# EAGLE design base_v2 (EAGLE 6.5.0)
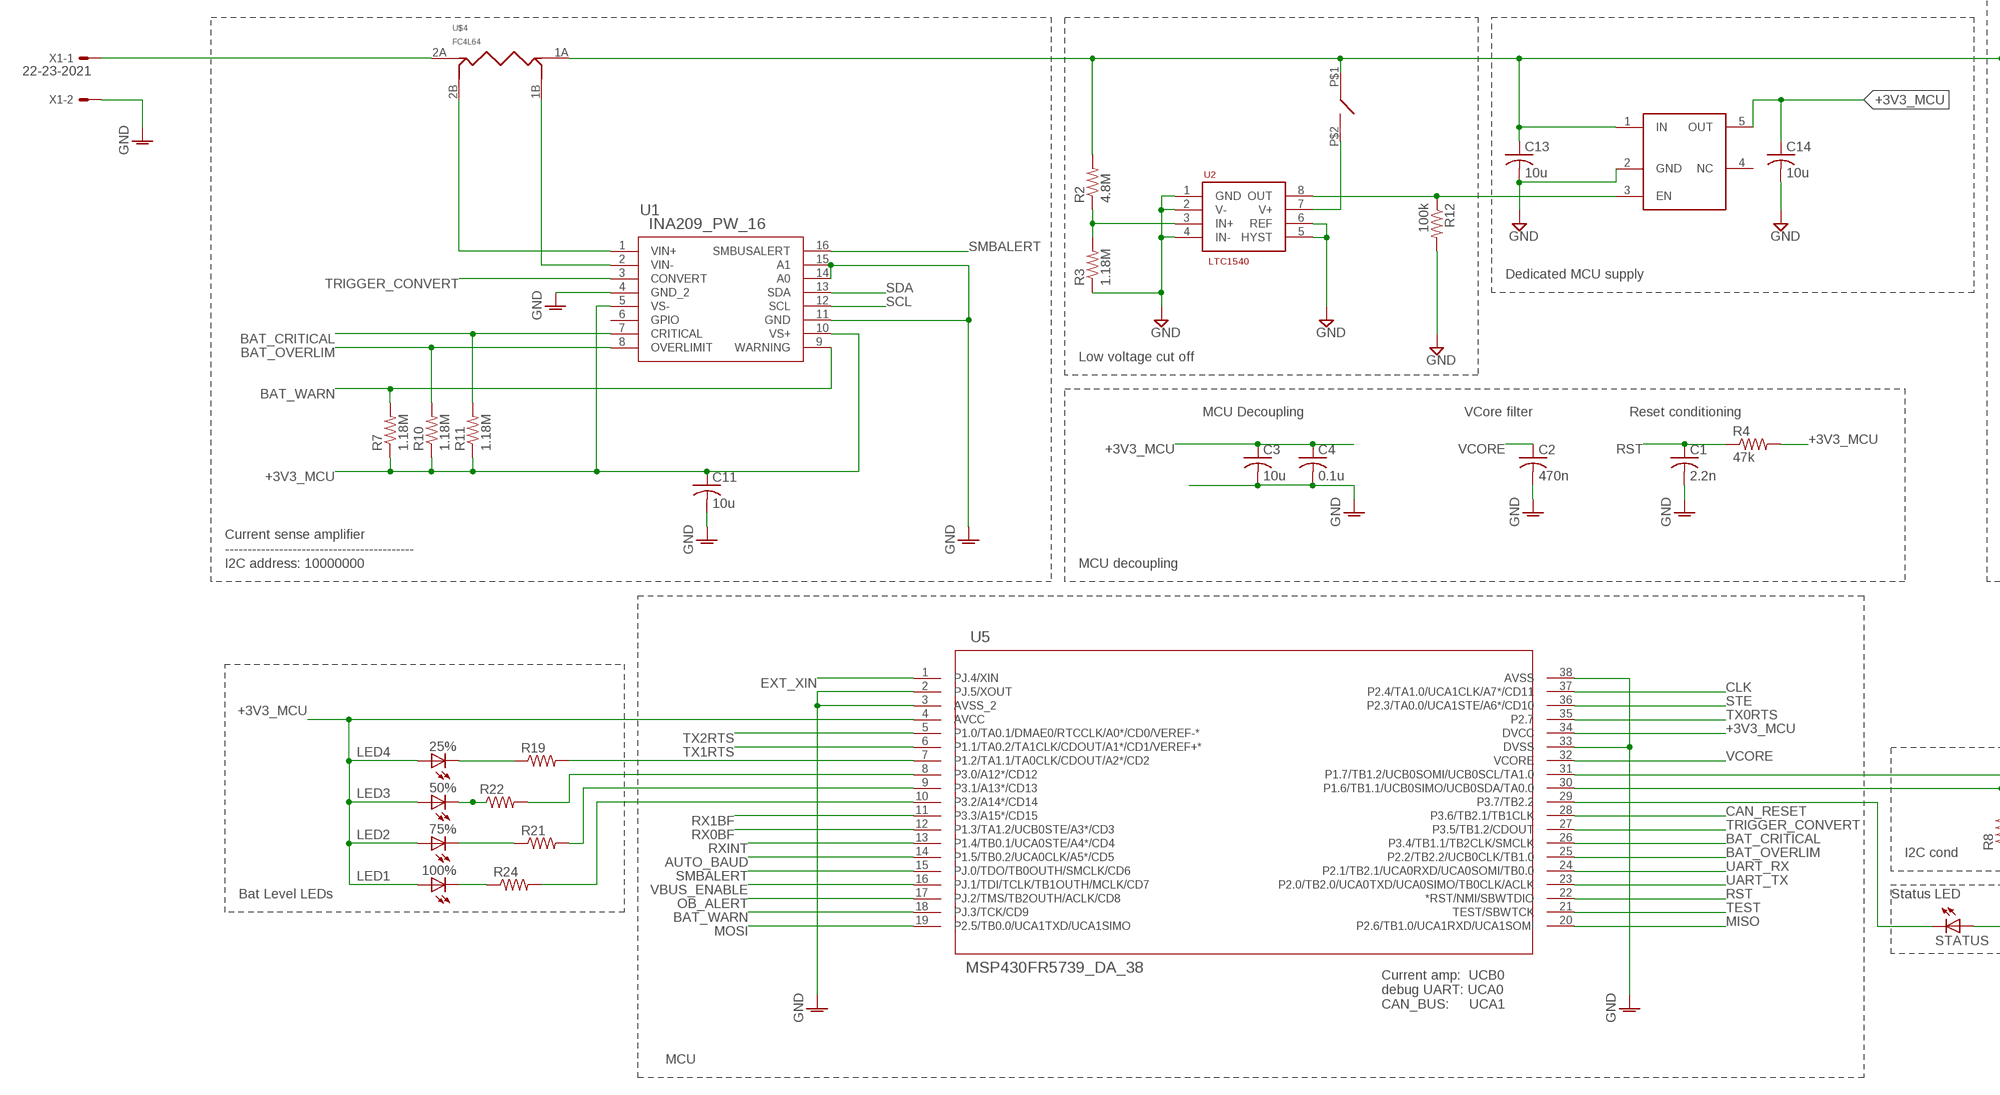
[diagram p0: schematic, sheet 1, part 1 of 2]
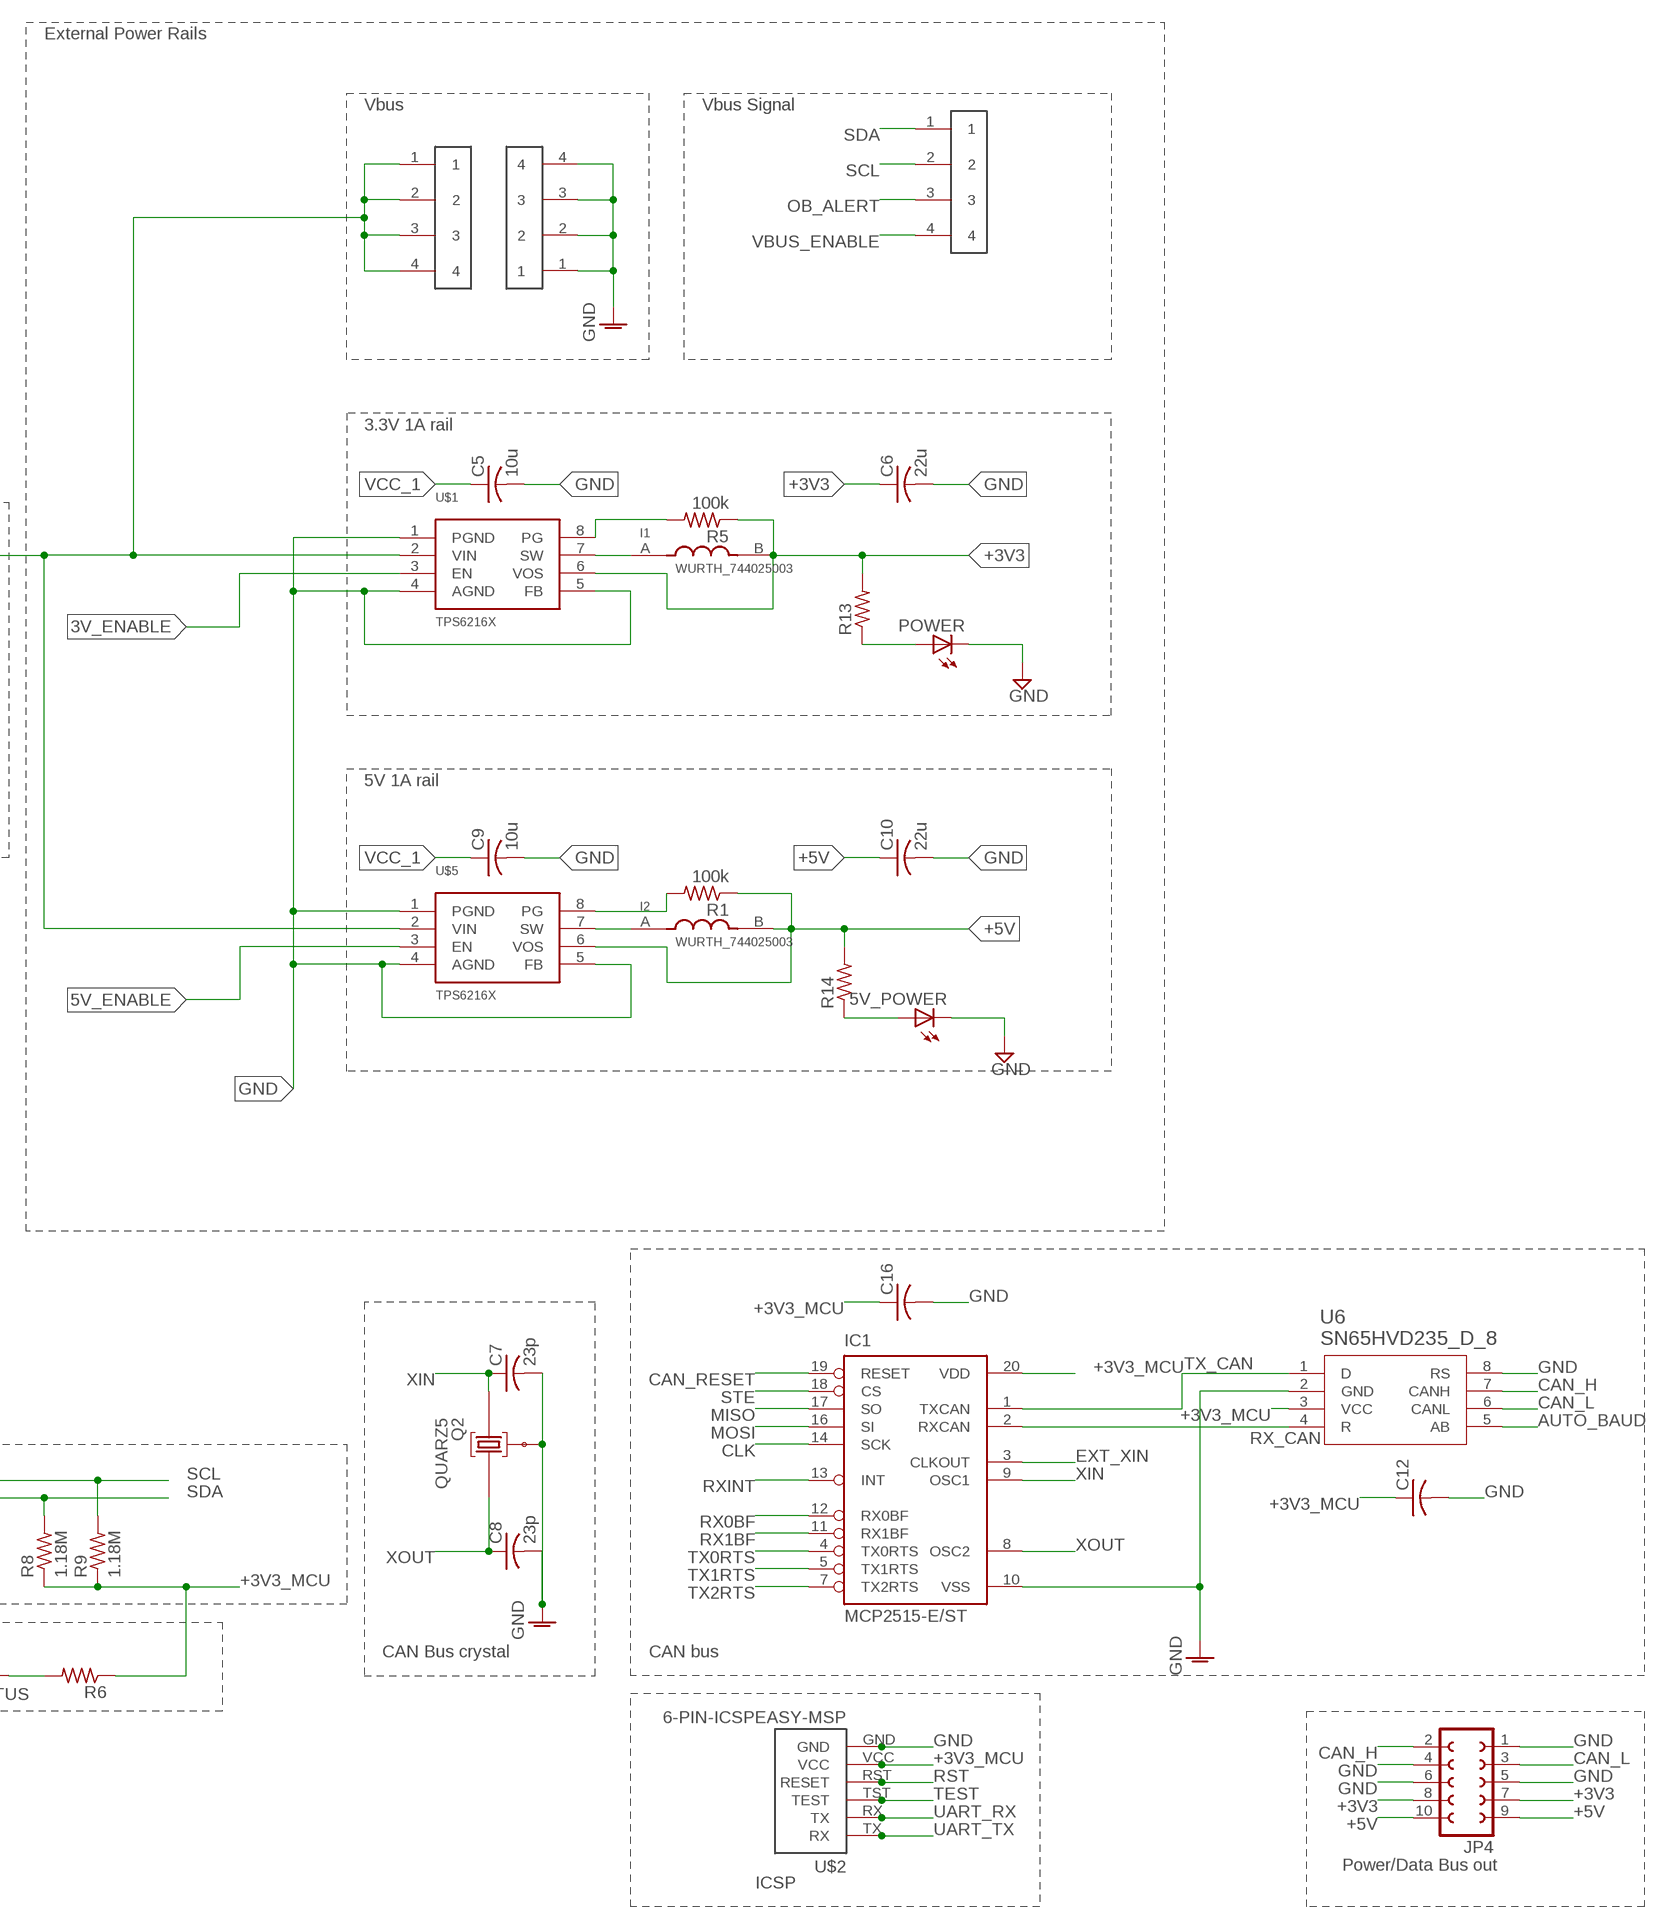
[diagram p1: schematic, sheet 1, part 2 of 2]

## Parts
5V_POWER  LEDCHIP-LED0603  [CHIP-LED0603]
25%  LEDCHIP-LED0603  [CHIP-LED0603]
50%  LEDCHIP-LED0603  [CHIP-LED0603]
75%  LEDCHIP-LED0603  [CHIP-LED0603]
100%  LEDCHIP-LED0603  [CHIP-LED0603]
C1  2.2n  C-USC1206  [C1206]
C2  470n  C-USC1206  [C1206]
C3  10u  C-USC1206  [C1206]
C4  0.1u  C-USC1206  [C1206]
C5  10u  C-USC1206  [C1206]
C6  22u  C-USC1206  [C1206]
C7  23p  C-USC1206  [C1206]
C8  23p  C-USC1206  [C1206]
C9  10u  C-USC1206  [C1206]
C10  22u  C-USC1206  [C1206]
C11  10u  C-USC1206  [C1206]
C12  C-USC0603  [C0603]
C13  10u  C-USC1206  [C1206]
C14  10u  C-USC1206  [C1206]
C16  C-USC0603  [C0603]
I1  WURTH_744025003  [INDUCTOR]
I2  WURTH_744025003  [INDUCTOR]
IC1  MCP2515-E/ST  [TSSOP20]
JP4  FE05-2  [FE05-2]
POWER  LEDCHIP-LED0603  [CHIP-LED0603]
Q2  QUARZ5  [QUARZ5]
R1  100k  R-US_R1206  [R1206]
R2  4.8M  R-US_R1206  [R1206]
R3  1.18M  R-US_R1206  [R1206]
R4  47k  R-US_R1206  [R1206]
R5  100k  R-US_R1206  [R1206]
R6  R-US_R0603  [R0603]
R7  1.18M  R-US_R0805  [R0805]
R8  1.18M  R-US_R0805  [R0805]
R9  1.18M  R-US_R0805  [R0805]
R10  1.18M  R-US_R0805  [R0805]
R11  1.18M  R-US_R0805  [R0805]
R12  100k  R-US_R1206  [R1206]
R13  R-US_R0603  [R0603]
R14  R-US_R0603  [R0603]
R19  R-US_R0603  [R0603]
R21  R-US_R0603  [R0603]
R22  R-US_R0603  [R0603]
R24  R-US_R0603  [R0603]
STATUS  LEDCHIP-LED0603  [CHIP-LED0603]
U1  INA209_PW_16  [PW16]
U2  LTC1540  [S8]
U5  MSP430FR5739_DA_38  [DA38]
U6  SN65HVD235_D_8  [D8]
U$1  TPS6216X  [DGK-8(VSSOP)]
U$2  6-PIN-ICSPEASY-MSP  [EASYMSP-6PIN]
U$3  1X4_HEADER  [1X4-.1HEADER]
U$4  FC4L64  [FC4L64]
U$5  TPS6216X  [DGK-8(VSSOP)]
U$6  TPS70930-Q1  [SOT-23]
U$7  A6SN  DIP1-SMT  [DIP1-SMT]
U$8  1X4_HEADER  [1X4-.1HEADER]
U$11  1X4_HEADER  [1X4-.1HEADER]
X1  22-23-2021  [22-23-2021]

## Nets
3V_ENABLE: U$1.3(EN)
5V_ENABLE: U$5.3(EN)
+3V3: C6.1 I1.B JP4.7 JP4.8 R5.1 R13.2 U$1.6(VOS)
+3V3_MCU: 25%.A 50%.A 75%.A 100%.A C3.1 C4.1 C11.1 C12.1 C14.1 C16.1 IC1.20(VDD) R4.2 R6.1 R7.1 R8.1 R9.1 R10.1 R11.1 U1.5(VS-) U1.10(VS+) U5.4(AVCC) U5.34(DVCC) U6.3(VCC) U$2.VCC U$6.5(OUT)
+5V: C10.1 I2.B JP4.9 JP4.10 R1.1 R14.2 U$5.6(VOS)
AUTO_BAUD: U5.14(P1.5/TB0.2/UCA0CLK/A5*/CD5) U6.5(AB)
BAT_CRITICAL: R11.2 U1.7(CRITICAL) U5.26(P3.4/TB1.1/TB2CLK/SMCLK)
BAT_OVERLIM: R10.2 U1.8(OVERLIMIT) U5.25(P2.2/TB2.2/UCB0CLK/TB1.0)
BAT_WARN: R7.2 U1.9(WARNING) U5.18(PJ.3/TCK/CD9)
CAN_H: JP4.2 U6.7(CANH)
CAN_L: JP4.3 U6.6(CANL)
CAN_RESET: IC1.19(RESET) U5.28(P3.6/TB2.1/TB1CLK)
CLK: IC1.14(SCK) U5.37(P2.4/TA1.0/UCA1CLK/A7*/CD11)
EXT_XIN: IC1.3(CLKOUT) U5.1(PJ.4/XIN)
GND: 5V_POWER.C C1.2 C2.2 C3.2 C4.2 C5.2 C6.2 C7.2 C8.2 C9.2 C10.2 C11.2 C12.2 C13.2 C14.2 C16.2 IC1.10(VSS) JP4.1 JP4.4 JP4.5 JP4.6 POWER.C Q2.GND@0 R3.1 R12.2 U1.4(GND_2) U1.11(GND) U1.14(A0) U1.15(A1) U2.1(GND) U2.2(V-) U2.4(IN-) U2.5(HYST) U2.6(REF) U5.2(PJ.5/XOUT) U5.3(AVSS_2) U5.33(DVSS) U5.38(AVSS) U6.2(GND) U6.8(RS) U$1.1(PGND) U$1.4(AGND) U$1.5(FB) U$2.GND U$3.1 U$3.2 U$3.3 U$3.4 U$5.1(PGND) U$5.4(AGND) U$5.5(FB) U$6.2(GND) X1.2
LED1: R24.2 U5.10(P3.2/A14*/CD14)
LED2: R21.2 U5.9(P3.1/A13*/CD13)
LED3: R22.2 U5.8(P3.0/A12*/CD12)
LED4: R19.2 U5.7(P1.2/TA1.1/TA0CLK/CDOUT/A2*/CD2)
MISO: IC1.17(SO) U5.20(P2.6/TB1.0/UCA1RXD/UCA1SOMI)
MOSI: IC1.16(SI) U5.19(P2.5/TB0.0/UCA1TXD/UCA1SIMO)
N$1: 25%.C R19.1
N$2: U2.7(V+) U$7.P$2
N$3: R2.1 R3.2 U2.3(IN+)
N$4: I1.A U$1.7(SW)
N$5: I2.A U$5.7(SW)
N$6: R5.2 U$1.8(PG)
N$7: R1.2 U$5.8(PG)
N$8: U$4.2A(1A) X1.1
N$9: POWER.A R13.1
N$10: 5V_POWER.A R14.1
N$11: U1.1(VIN+) U$4.2B(1B)
N$12: U1.2(VIN-) U$4.1B(2B)
N$13: R6.2 STATUS.A
N$33: 50%.C R22.1
N$34: 75%.C R21.1
N$35: 100%.C R24.1
NC: STATUS.C U5.29(P3.7/TB2.2)
OB_ALERT: U5.17(PJ.2/TMS/TB2OUTH/ACLK/CD8) U$8.3
RST: C1.1 R4.1 U5.22(*RST/NMI/SBWTDIO) U$2.RST(RESET)
RX0BF: IC1.12(RX0BF) U5.12(P1.3/TA1.2/UCB0STE/A3*/CD3)
RX1BF: IC1.11(RX1BF) U5.11(P3.3/A15*/CD15)
RX_CAN: IC1.2(RXCAN) U6.4(R)
RXINT: IC1.13(INT) U5.13(P1.4/TB0.1/UCA0STE/A4*/CD4)
SCL: R9.2 U1.12(SCL) U5.31(P1.7/TB1.2/UCB0SOMI/UCB0SCL/TA1.0) U$8.2
SDA: R8.2 U1.13(SDA) U5.30(P1.6/TB1.1/UCB0SIMO/UCB0SDA/TA0.0) U$8.1
SMBALERT: U1.16(SMBUSALERT) U5.15(PJ.0/TDO/TB0OUTH/SMCLK/CD6)
STE: IC1.18(CS) U5.36(P2.3/TA0.0/UCA1STE/A6*/CD10)
TEST: U5.21(TEST/SBWTCK) U$2.TST(TEST)
TRIGGER_CONVERT: U1.3(CONVERT) U5.27(P3.5/TB1.2/CDOUT)
TX0RTS: IC1.4(TX0RTS) U5.35(P2.7)
TX1RTS: IC1.5(TX1RTS) U5.6(P1.1/TA0.2/TA1CLK/CDOUT/A1*/CD1/VEREF+*)
TX2RTS: IC1.7(TX2RTS) U5.5(P1.0/TA0.1/DMAE0/RTCCLK/A0*/CD0/VEREF-*)
TX_CAN: IC1.1(TXCAN) U6.1(D)
UART_RX: U5.24(P2.1/TB2.1/UCA0RXD/UCA0SOMI/TB0.0) U$2.RX(TX)
UART_TX: U5.23(P2.0/TB2.0/UCA0TXD/UCA0SIMO/TB0CLK/ACLK) U$2.TX(RX)
VBUS_ENABLE: U5.16(PJ.1/TDI/TCLK/TB1OUTH/MCLK/CD7) U$8.4
VCC_1: C5.1 C9.1 C13.1 R2.2 U$1.2(VIN) U$4.1A(2A) U$5.2(VIN) U$6.1(IN) U$7.P$1 U$11.1 U$11.2 U$11.3 U$11.4
VCORE: C2.1 U5.32(VCORE)
VENABLE: R12.1 U2.8(OUT) U$6.3(EN)
XIN: C7.1 IC1.9(OSC1) Q2.2
XOUT: C8.1 IC1.8(OSC2) Q2.1
Unconnected: U1.6(GPIO) U$6.4(NC)

## Notes on the sheet
- External Power Rails
- Vbus | Vbus Signal
- 3.3V 1A rail
- 5V 1A rail
- Dedicated MCU supply
- Low voltage cut off
- MCU Decoupling | VCore filter | Reset conditioning
- Current sense amplifier
  ------------------------------------------
  I2C address: 10000000
- MCU decoupling
- I2C cond
- Bat Level LEDs | Status LED
- CAN Bus crystal | CAN bus
- Current amp:  UCB0
  debug UART: UCA0
  CAN_BUS:     UCA1
- MCU
- Power/Data Bus out
- ICSP

## Library data of the parts
5V_POWER 25% 50% 75% 100% POWER STATUS = adafruit:LED: LED OSRAM: - CHIPLED LG R971, LG N971, LY N971, LG Q971, LY Q971, LO R971, LY R971 LH N974, LH R974 LS Q976, LO Q976, LY Q976 LO Q996 - Hyper CHIPLED LW Q18S LB Q993, LB Q99A, LB R99A - SideLED LS A670, LO A670, LY A670, LG A670, LP A670 LB A673, LV A673, LT A673, LW A673 LH A674 LY A675 LS A676, LA A676, LO A676, LY A676, LW A676 LS A679, LY A679, LG A679 - Hyper Micro SIDELED® LS Y876, LA Y876, LO Y876, LY Y876 LT Y87S - SmartLED LW L88C, LW L88S LB L89C, LB L89S, LG L890 LS L89K, LO L89K, LY L89K LS L896, LA L896, LO L896, LY L896 - TOPLED LS T670, LO T670, LY T670, LG T670, LP T670 LSG T670, LSP T670, LSY T670, LOP T670, LYG T670 LG T671, LOG T671, LSG T671 LB T673, LV T673, LT T673, LW T673 LH T674 LS T676, LA T676, LO T676, LY T676, LB T676, LH T676, LSB T676, LW T676 LB T67C, LV T67C, LT T67C, LS T67K, LO T67K, LY T67K, LW E67C LS E67B, LA E67B, LO E67B, LY E67B, LB E67C, LV E67C, LT E67C LW T67C LS T679, LY T679, LG T679 LS T770, LO T770, LY T770, LG T770, LP T770 LB T773, LV T773, LT T773, LW T773 LH T774 LS E675, LA E675, LY E675, LS T675 LS T776, LA T776, LO T776, LY T776, LB T776 LHGB T686 LT T68C, LB T68C - Hyper Mini TOPLED® LB M676 - Mini TOPLED Santana® LG M470 LS M47K, LO M47K, LY M47K Source: http://www.osram.convergy.de/
C1-C14 C16 = adafruit:C-US: CAPACITOR, American symbol
I1 I2 = misc_passives:WURTH_744025003
IC1 = mcp2515:MCP2515
JP4 = con-lsta:FE05-2: FEMALE HEADER; OC_FARNELL: unknown; OC_NEWARK: unknown
Q2 = sMSP430:QUARZ5
R1-R14 R19 R21 R22 R24 = adafruit:R-US_: RESISTOR, American symbol
U1 = TexasInstruments:INA209_PW_16; DATASHEETURL: http://www.ti.com/lit/gpn/INA209; DESCRIPTION: High-Side Measurement, Bi-Directional Current/Power Monitor with I2C Interface; FAMILY_NAME: CURRENT SHUNT MONITOR; GENERIC_PART_NUMBER: INA209; INDUSTRY_STD_PKG_TYPE: TSSOP; MANUFACTURER: Texas Instruments; MANUFACTURER_PART_NUMBER: ina209_pw_16; PACKAGE_DESIGNATOR: PW; PIN_COUNT: 16; VENDOR: Texas Instruments
U2 = linear:LTC1540
U5 = TexasInstruments:MSP430FR5739_DA_38; DATASHEETURL: http://www.ti.com/lit/gpn/MSP430FR5739; DESCRIPTION: MSP430FR573x,MSP430FR572x Mixed Signal Microcontroller; FAMILY_NAME: FRAM Series; GENERIC_PART_NUMBER: MSP430FR5739; INDUSTRY_STD_PKG_TYPE: TSSOP; MANUFACTURER: Texas Instruments; MANUFACTURER_PART_NUMBER: msp430fr5739_da_38; PACKAGE_DESIGNATOR: DA; PIN_COUNT: 38; VENDOR: Texas Instruments
U6 = TexasInstruments:SN65HVD235_D_8; DATASHEETURL: http://www.ti.com/lit/gpn/SN65HVD235; DESCRIPTION: 3.3V CAN with Standby Mode, Autobaud Loop-back; FAMILY_NAME: CAN; GENERIC_PART_NUMBER: SN65HVD235; INDUSTRY_STD_PKG_TYPE: SOIC; MANUFACTURER: Texas Instruments; MANUFACTURER_PART_NUMBER: sn65hvd235_d_8; PACKAGE_DESIGNATOR: D; PIN_COUNT: 8; VENDOR: Texas Instruments
U$1 U$5 = TexasInstruments:TPS6216X
U$2 = LaunchFET:6-PIN-ICSP: 6 pin easy-msp formatted headers. Designed to make programming target boards with MSP430 Launchpad easier. EASYMSP: standard .05" pitch header to match launchpad SAFEMSP: .05" header with .025" offset Vcc to keep Geordi away
U$3 U$8 U$11 = connectors:1X4_HEADER
U$4 = misc_passives:FC4L64
U$6 = TexasInstruments:TPS70930-Q1
U$7 = misc_passives:DIP1-SMT
X1 = con-molex:22-23-2021: .100" (2.54mm) Center Header - 2 Pin; MF: MOLEX; MPN: 22-23-2021; OC_FARNELL: 1462926; OC_NEWARK: 25C3832

## Board
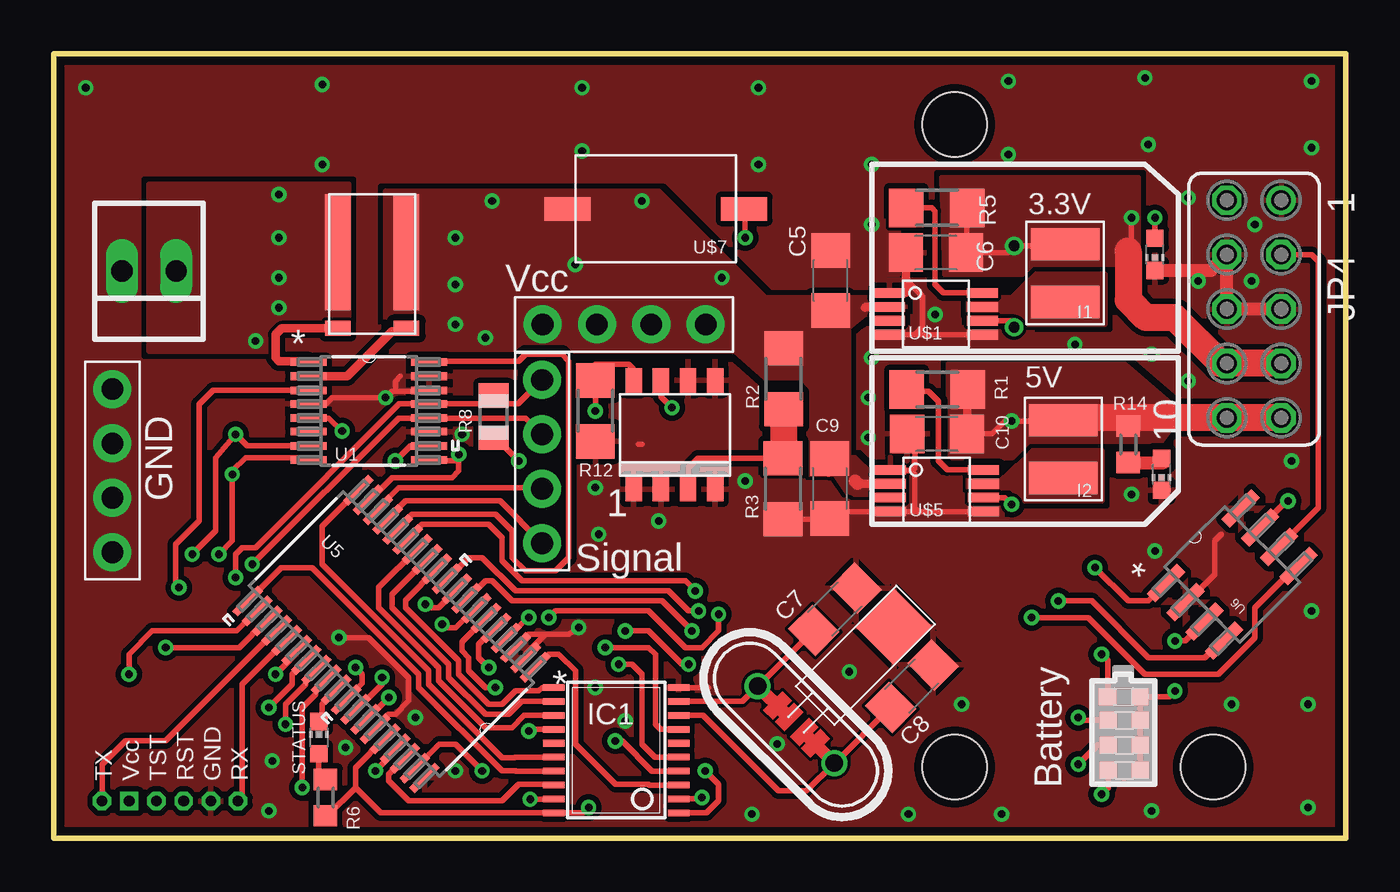
[diagram p2: board, top side]
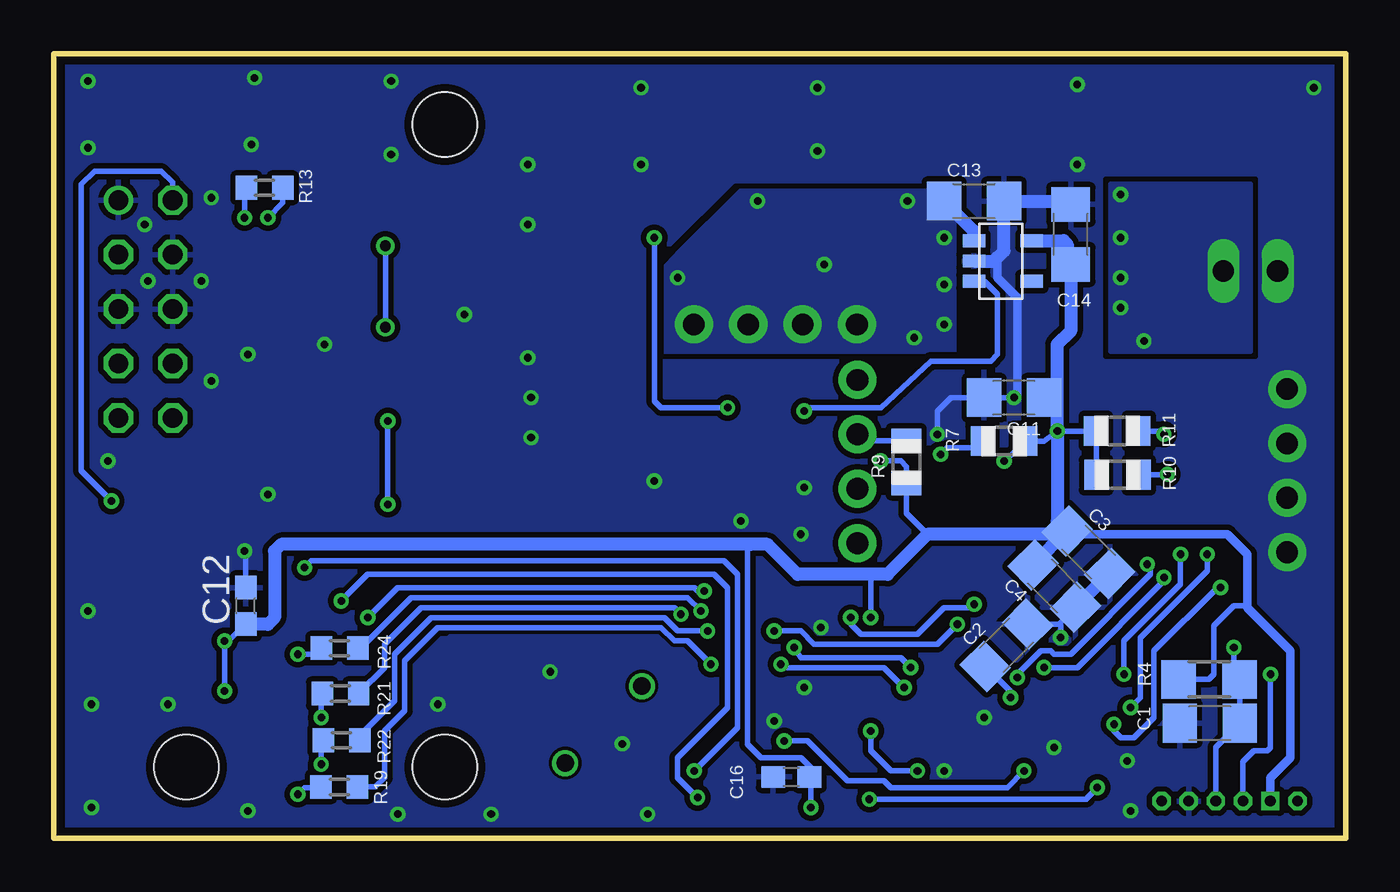
[diagram p3: board, bottom side, seen from below]

Size 60.37 x 36.63 mm. Coordinates in mm from the lower left corner, seen from the top.
Outline: 0,36.63 60.37,36.63 60.37,0 0,0 0,36.63
Copper layers (1*16): Top 0.0356mm / dielectric 1.5011mm / Bottom 0.0356mm
Design rules "oshpark": minimum track width 6mil, minimum drill 13mil, track to track 6mil, track to pad 6mil, pad to pad 6mil, via to via 6mil, smd to smd 6mil, copper to edge 15mil, drill to drill 6mil, minimum pad ring 7mil, minimum via ring 7mil, stop-mask expansion 4mil, vias tented up to drill 0mil, thermal gap 10mil
Holes 3 mm at 42.09,3.31 42.09,33.31 54.16,3.31

### Footprints (pad centres in the part's own frame; a part is rotated, then mirrored left to right if it is on the bottom)
CHIP-LED0603 = smd 0.8 x 0.8: A 0,-0.75; C 0,0.75
C1206 = smd 1.6 x 1.8: 1 -1.4,0; 2 1.4,0
C0603 = smd 1.1 x 1: 1 -0.85,0; 2 0.85,0
INDUCTOR = smd 1.5 x 3.2: A -1.35,0; B 1.35,0
TSSOP20 = smd 0.305 x 0.991: 1 -2.925,-2.918; 2 -2.275,-2.918; 3 -1.625,-2.918; 4 -0.975,-2.918; 5 -0.325,-2.918; 6 0.325,-2.918; 7 0.975,-2.918; 8 1.625,-2.918; 9 2.275,-2.918; 10 2.925,-2.918; 11 2.925,2.918; 12 2.275,2.918; 13 1.625,2.918; 14 0.975,2.918; 15 0.325,2.918; 16 -0.325,2.918; 17 -0.975,2.918; 18 -1.625,2.918; 19 -2.275,2.918; 20 -2.925,2.918
FE05-2 = drill 0.914: 1 -5.08,1.27 | drill 0.914 octagon: 2 -5.08,-1.27; 3 -2.54,1.27; 4 -2.54,-1.27; 5 0,1.27; 6 0,-1.27; 7 2.54,1.27; 8 2.54,-1.27; 9 5.08,1.27; 10 5.08,-1.27
QUARZ5 = drill 0.813: 1 1.53,1.773; 2 1.52,-3.303 | smd 2.54 x 2.54: GND@0 -4.941,-0.762
R1206 = smd 1.6 x 1.803: 1 -1.422,0; 2 1.422,0
R0603 = smd 1 x 1.1: 1 -0.85,0; 2 0.85,0
R0805 = smd 1.1 x 1.4: 1 -1,0; 2 1,0
PW16 = smd 1.676 x 0.356: 1 -2.819,2.286; 2 -2.819,1.626; 3 -2.819,0.965; 4 -2.819,0.33; 5 -2.819,-0.33; 6 -2.819,-0.965; 7 -2.819,-1.626; 8 -2.819,-2.286; 9 2.819,-2.286; 10 2.819,-1.626; 11 2.819,-0.965; 12 2.819,-0.33; 13 2.819,0.33; 14 2.819,0.965; 15 2.819,1.626; 16 2.819,2.286
S8 = smd 0.762 x 1.143: 1 -2.54,-2.54; 2 -1.27,-2.54; 3 0,-2.54; 4 1.27,-2.54; 5 1.27,2.54; 6 0,2.54; 7 -1.27,2.54; 8 -2.54,2.54
DA38 = smd 1.676 x 0.356: 1 -3.658,5.842; 2 -3.658,5.207; 3 -3.658,4.547; 4 -3.658,3.912; 5 -3.658,3.251; 6 -3.658,2.591; 7 -3.658,1.956; 8 -3.658,1.295; 9 -3.658,0.66; 10 -3.658,0; 11 -3.658,-0.66; 12 -3.658,-1.295; 13 -3.658,-1.956; 14 -3.658,-2.591; 15 -3.658,-3.251; 16 -3.658,-3.912; 17 -3.658,-4.547; 18 -3.658,-5.207; 19 -3.658,-5.842; 20 3.658,-5.842; 21 3.658,-5.207; 22 3.658,-4.547; 23 3.658,-3.912; 24 3.658,-3.251; 25 3.658,-2.591; 26 3.658,-1.956; 27 3.658,-1.295; 28 3.658,-0.66; 29 3.658,0; 30 3.658,0.66; 31 3.658,1.295; 32 3.658,1.956; 33 3.658,2.591; 34 3.658,3.251; 35 3.658,3.912; 36 3.658,4.547; 37 3.658,5.207; 38 3.658,5.842
D8 = smd 1.981 x 0.559: 1 -2.464,1.905; 2 -2.464,0.635; 3 -2.464,-0.635; 4 -2.464,-1.905; 5 2.464,-1.905; 6 2.464,-0.635; 7 2.464,0.635; 8 2.464,1.905
DGK-8(VSSOP) = smd 0.45 x 1.45: 1 -0.975,-2.175; 2 -0.325,-2.175; 3 0.325,-2.175; 4 0.975,-2.175; 5 0.975,2.175; 6 0.325,2.175; 7 -0.325,2.175; 8 -0.975,2.175
EASYMSP-6PIN = drill 0.5 octagon: GND 0,-1.27; RST 0,0; RX 0,-2.54; TST 0,1.27; TX 0,3.81 | drill 0.5 square: VCC 0,2.54
1X4-.1HEADER = drill 1.016 pad 1.778: 1 -5.08,0; 2 -2.54,0; 3 0,0; 4 2.54,0
FC4L64 = smd 1.2 x 5.4: 1A -1.6,2.7; 2A 1.6,2.7 | smd 1.2 x 0.7: 1B -1.6,6.25; 2B 1.6,6.25
SOT-23 = smd 0.6 x 1.05: 1 -0.95,0; 2 0,0; 3 0.95,0; 4 0.95,2.7; 5 -0.95,2.7
DIP1-SMT = smd 1.1 x 2.15: P$1 0,4.125; P$2 0,-4.125
22-23-2021 = drill 1 long: 1 -1.27,0; 2 1.27,0

### Placement (x,y rotation side)
5V_POWER  51.75,16.98 180 top
25%  50.01,3.17 90 top
50%  50.01,4.34 90 top
75%  50.01,5.51 90 top
100%  49.99,6.6 90 top
C1  6.36,5.36 180 bottom
C2  15.86,9 45 bottom
C3  12.03,13.35 315 bottom
C4  13.62,11.77 315 bottom
C5  36.29,26.03 90 top
C6  41.22,27.33 180 top
C7  36.5,10.68 45 top
C8  40.09,7.09 45 top
C9  36.26,16.32 270 top
C10  41.27,18.87 180 top
C11  15.5,20.56 180 bottom
C12  51.39,10.84 90 bottom
C13  17.37,29.74 0 bottom
C14  12.86,28.18 90 bottom
C16  25.91,2.85 180 bottom
I1  47.25,26.38 90 top
I2  47.16,18.16 90 top
IC1  26.28,4.1 90 top
JP4  56.07,24.7 270 top
POWER  51.44,27.25 180 top
Q2  36.3,5.83 225 top
R1  41.27,20.94 180 top
R2  34.1,21.44 90 top
R3  34.07,16.31 90 top
R4  6.39,7.41 180 bottom
R5  41.25,29.43 180 top
R6  12.7,1.89 90 top
R7  15.97,18.54 180 bottom
R8  20.56,19.67 90 top
R9  20.54,17.56 90 bottom
R10  10.67,16.96 0 bottom
R11  10.68,19 0 bottom
R12  25.31,19.94 270 top
R13  50.51,30.36 0 bottom
R14  50.2,18.38 90 top
R19  47.02,2.39 0 bottom
R21  46.97,6.74 0 bottom
R22  46.91,4.56 0 bottom
R24  47,8.86 0 bottom
STATUS  12.39,4.69 0 top
U1  14.73,19.94 0 top
U2  29.64,18.83 0 top
U5  15.78,9.52 225 top
U6  55.06,12.31 45 top
U$1  41.22,24.48 270 top
U$2  6.08,1.72 90 top
U$3  2.75,18.42 90 top
U$4  14.88,30.05 180 top
U$5  41.26,16.22 270 top
U$6  17.37,26.94 270 bottom
U$7  28.13,29.38 90 top
U$8  22.82,16.31 270 top
U$11  27.92,23.98 0 top
X1  4.46,26.47 180 top

### Tracks (layer width: path | path; a pad name or v marks a point on that pad's centre or on a via)
+3V3  (via drill 0.36, 0.5)
  Top 0.254: U$1.6 44.7,24.15 v44.86,23.85 | I1.B 47.17,27.65 v44.86,27.65 44.55,27.33 C6.1 42.67,27.39 R5.1 | v50.35,28.96 50.35,27.56 50.2,27.41
  Top 1.27: JP4.7 JP4.8 54.51,22.16 52.38,24.29 51.03,24.29 50.2,25.12 50.2,27.41
  Bottom 0.254: v44.86,23.85 v44.86,27.65 | R13.2 49.66,29.66 v50.35,28.96
  pour Top (no thermals): 41.64,26.32 45.22,26.32 45.69,26.78 50.66,26.78 50.66,30.83 41.49,30.83
+3V3_MCU  (via drill 0.36)
  Top 0.254: U1.5 12.84,19.61 v13.48,19.01 | 20.98,9.23 21.13,9.23 U5.4 21.13,9.39 v22.19,10.29 | U6.3 52.85,9.2 v52.38,9.2 | 17.62,18.38 U1.10 16.68,18.31 v15.97,17.6 | R8.1 20.64,18.59 20.74,18.59 v21.73,17.6 | U5.34 15.45,4.64 14.1,3.29 14.1,2.36 | 25%.A 50%.A 75%.A 50.76,6.57 100%.A 52.11,6.6 v52.38,6.87 | 14.1,2.36 15.29,1.18 IC1.20 24.75,1.18 v24.99,1.43 | R6.1 12.79,1.04 14.1,2.36
  Bottom 0.254: C11.1 13.48,20.56 | 13.35,19.29 v13.48,19.01 | R10.1 11.67,18.99 R11.1 v13.48,19.01 | v13.48,19.01 14.1,18.54 R7.1 15.9,17.6 v15.97,17.6 | C12.1 52.17,9.2 v52.38,9.2 v52.38,6.87 | v21.73,17.6 20.79,17.6 20.54,17.35 R9.1 20.54,15.17 19.55,14.18 | v22.19,10.29 22.19,12.32 | 4.61,10.76 4.69,10.84 5.24,10.84 6.17,9.9 6.17,7.65 6.41,7.41 R4.2 | 27.79,13.72 27.95,13.56 27.95,4.38 27.33,3.76 25.46,3.76 24.99,3.29 24.99,2.92 C16.1 24.99,2.79 v24.99,1.43 | C14.1 | 13.17,14.18 13.17,14.19 C3.1
  Bottom 0.406: C3.1 12.86,14.18 5.55,14.18 4.61,13.25 4.61,10.76 2.59,8.74 2.59,3.76 3.54,2.81 U$2.VCC
  Bottom 0.61: U$6.5 13.19,27.89 13.02,27.72 13.02,26.94 C14.1 | C14.1 12.86,23.67 13.48,23.05 13.48,20.56 v13.48,19.01 13.48,14.81 C3.1 C4.1 14.61,12.74 | 13.17,14.18 19.55,14.18 21.42,12.32 22.19,12.32 25.62,12.32 27.02,13.72 27.79,13.72 49.73,13.72 50.04,13.4 50.04,10.29 50.35,9.98 51.38,9.98 C12.1
+5V  (via drill 0.36)
  Top 0.254: C10.1 43.84,18.87 44.44,19.47 v44.75,19.47 47.12,19.47 I2.B | U$5.6 44.44,15.89 v44.75,15.58
  Top 0.406: R1.1 42.69,18.89 C10.1
  Top 1.016: 47.27,19.62 I2.B
  Top 1.27: JP4.9 JP4.10 47.27,19.62
  Bottom 0.254: v44.75,15.58 v44.75,19.47
  pour Top (isolate 0.305, no thermals): 41.8,17.76 44.75,17.76 45.53,18.54 51.75,18.54 52.22,19.16 52.22,20.25 50.04,22.12 41.8,22.12
AUTO_BAUD  (via drill 0.36)
  Top 0.254: U6.5 58.05,12.7 56.11,10.76 56.11,9.36 54.4,7.65 50.98,7.65 48.33,10.29 v45.69,10.29 | U5.14 16.53,13.97 17.22,14.65 20.33,14.65 20.95,14.03 20.95,12.94 21.88,12 29.51,12 v29.97,11.54
  Bottom 0.254: v45.69,10.29 44.29,11.69 30.44,11.69 30.28,11.54 v29.97,11.54
BAT_CRITICAL  (via drill 0.36)
  Top 0.254: U1.7 9.04,18.31 v8.5,18.85 7.57,17.76 7.57,14.34 v6.48,13.25 | U5.26 11.81,8.31 11.15,7.65 11.15,7.18 v10.06,6.09
  Bottom 0.254: R11.2 8.66,19.01 v8.5,18.85 | v6.48,13.25 6.48,12.47 9.59,9.36 9.59,6.56 v10.06,6.09
BAT_OVERLIM  (via drill 0.36)
  Top 0.254: U1.8 11.8,17.76 8.97,17.76 8.35,17.14 v8.35,16.98 8.35,13.87 v7.73,13.25 | U5.25 11.33,8.77 11.33,8.61 v10.37,7.65
  Bottom 0.254: R10.2 8.37,16.96 v8.35,16.98 | v7.73,13.25 7.73,11.85 10.37,9.2 v10.37,7.65
BAT_WARN  (via drill 0.36)
  Top 0.254: U1.9 17.59,17.6 18.93,17.6 v18.93,17.92 18.93,17.14 18.62,16.83 15.82,16.83 14.78,15.79 U5.18
  Bottom 0.254: R7.2 16.97,18.47 17.22,18.23 18.62,18.23 v18.93,17.92
CAN_H  (via drill 0.36)
  Top 0.254: v57.67,15.74 57.59,15.74 U6.7
  Bottom 0.254: JP4.2 54.8,30.61 55.33,31.14 58.44,31.14 59.07,30.52 59.07,17.14 v57.67,15.74
CAN_L
  Top 0.254: JP4.3 58.76,27.24 59.07,26.94 59.07,15.42 U6.6
CAN_RESET  (via drill 0.36)
  Top 0.254: U5.28 12.73,7.36 12.24,6.87 12.24,6.71 11.62,6.09 v11.62,2.36 | IC1.19 23.35,1.81 v22.26,1.81
  Bottom 0.254: v11.62,2.36 12.08,1.89 arc90 12.16,1.81 v22.26,1.81
CLK  (via drill 0.36)
  Top 0.254: U5.37 18,4.38 18.77,4.38 v20.02,3.14 | IC1.14 22.27,5.08 v22.19,5
  Bottom 0.254: v20.02,3.14 21.26,3.14 22.19,4.07 v22.19,5
EXT_XIN
  Top 0.254: IC1.3 27.83,2.48 27.79,2.51 26.24,2.51 24.37,4.38 24.37,7.8 23.59,8.58 23.13,8.58 22.52,7.98 U5.1
GND  (via drill 0.36)
  Top 0.254: U$1.4 40.24,23.5 40.26,23.52 | 40.26,23.52 40.58,23.84 40.58,25.3 39.82,26.06 | U$1.5 40.29,23.5 40.26,23.52 | R3.1 36.22,14.89 C9.2 36.58,15.24 U$5.4 40.4,15.24 | C10.2 39.87,18.76 40.24,18.38 40.24,17.29 40.09,17.14 | U$5.1 39.14,17.14 40.09,17.14 | 40.4,15.24 U$5.5 | 40.09,17.14 40.24,16.98 40.24,15.4 40.4,15.24 | 15.97,20.87 15.82,20.87 v15.5,20.56 13.02,20.56 12.72,20.27 U1.4 | 15.97,20.87 17.51,20.87 | 16.2,21.56 15.97,21.34 15.97,20.87 | 27.33,18.38 27.48,18.38 | IC1.10 30.59,7.03 30.6,7.03 | U6.2 52.94,11.01 54.24,12.32 54.24,13.87 54.55,14.18 | v51.44,13.4 51.6,13.4 | 18.9,18.97 v19.08,18.85 | U5.33 15.03,5.15 15.66,5.78 15.97,5.78 16.59,6.4 16.59,7.49 14.73,9.36 v13.33,9.36 | U5.3 22.19,9.52 22.97,9.52 | 22.97,9.52 24.06,9.52 v24.53,9.83 | U5.2 22.05,8.59 22.97,9.52
  Top 0.406: U$1.1 39.82,25.45 39.82,26.06 C6.2
  Top 0.61: POWER.C 54.06,26.5 JP4.4 JP4.6 JP4.5
  Bottom 0.254: C12.2 51.39,13.35 v51.44,13.4 | v15.5,20.56 C11.2 18.46,20.56 19.08,19.94 v19.08,18.85 | C2.2 13.42,9.99 | 13.42,9.99 C4.2 | v13.33,9.36 13.33,9.9 13.42,9.99 | v24.53,9.83 24.53,9.98
  Bottom 0.406: 16.28,27.09 16.28,26.16 15.35,25.23 15.35,20.72 v15.5,20.56
  Bottom 0.61: U$6.2 16.44,26.94 16.28,27.09 15.97,27.41 C13.2 | C13.2 | C13.2 13.02,29.74 C14.2 | C3.2 C4.2
  other vias: 37.17,7.77 33.8,4.4 1.5,35.03 18.77,3.14 16.9,5.63 25.31,7.03 26.71,5.47 10.22,3.6 10.06,1.27 32.62,1.11 39.93,1.11 44.29,1.11 42.42,6.25 51.29,1.27 58.6,1.42 58.6,6.25 58.75,10.6 55.02,6.25 57.82,17.6 50.35,16.05 56.11,28.65 55.95,26.01 53,29.89 53.47,26.01 38.22,28.65 38.22,31.45 38.22,22.43 38.06,18.69 38.06,20.56 41.17,24.45 47.71,23.05 44.6,31.92 44.6,35.34 58.75,35.34 58.75,32.23 51.13,32.38 50.98,35.5 32.93,31.45 32.93,35.03 24.68,35.03 24.68,32.07 12.55,35.18 12.55,31.45 25.31,16.36 25.46,14.18 28.26,14.8 32.31,16.67 51.29,22.58 53,21.34 13.64,4.23
  pour Top: 43.01,8.21 38.97,4.17 38.97,2.38 37.62,1.03 35.83,1.03 30.44,6.42 30.44,8.21 31.78,9.56 33.58,9.56 37.62,13.6
  pour Bottom: 43.01,8.21 38.97,4.17 38.97,2.38 37.62,1.03 35.83,1.03 30.44,6.42 30.44,8.21 31.78,9.56 33.58,9.56 37.62,13.6
  pour Top (isolate 0.254, rank 2, no thermals): 4.15,30.52 0.57,30.52 0.57,10.91 4.15,10.91
  pour Bottom (isolate 0.254, rank 2, no thermals): 4.15,30.52 0.57,30.52 0.57,10.91 4.15,10.91
  pour Top (isolate 0.254, rank 6): -0.05,36.58 -0.05,0.02 60.47,0.02 60.47,36.58
  pour Bottom (isolate 0.254, rank 6): -0.05,36.58 -0.05,0.02 60.47,0.02 60.47,36.58
  pour Top (rank 6, no thermals): 39.46,28.81 39.46,26.32 34.64,26.32 34.64,28.81
  pour Top (rank 6, no thermals): 39.46,28.81 39.46,26.32 34.64,26.32 34.64,28.81
  pour Top (rank 6, no thermals): 32.46,16.67 32.62,16.83 44.29,16.83 44.29,13.87 32.46,13.87
  pour Top (rank 6, no thermals): 38.06,23.83 45.69,23.83 45.69,22.74 38.06,22.74
LED1  (via drill 0.36)
  Top 0.254: U5.10 18.41,12.11 19.39,13.09 20.02,13.09 21.57,11.54 28.73,11.54 29.66,10.6 v30.13,10.6
  Bottom 0.254: R24.2 46.03,8.86 43.66,11.23 30.75,11.23 v30.13,10.6
LED2  (via drill 0.36)
  Top 0.254: U5.9 18.83,11.6 17.99,10.76 17.53,10.76 v17.37,10.92 | v31.06,10.45 31.06,9.67 30.28,8.89 29.51,8.89 27.79,10.6 23.44,10.6 v23.13,10.29
  Bottom 0.254: R21.2 44.91,7.96 44.91,9.05 43.2,10.76 31.37,10.76 v31.06,10.45 | v17.37,10.92 17.53,10.76 18.77,10.76 20.02,9.52 22.66,9.52 23.13,9.98 v23.13,10.29
LED3  (via drill 0.36)
  Top 0.254: U5.8 19.36,11.19 20.17,12 20.48,12 21.42,11.07 28.42,11.07 v29.82,9.67
  Bottom 0.254: R22.2 46.06,4.78 44.44,6.4 44.44,8.58 42.73,10.29 31.84,10.29 31.22,9.67 v29.82,9.67
LED4  (via drill 0.36)
  Top 0.254: U5.7 19.67,10.72 18.77,9.83 18.3,9.83 v18.15,9.98 | v29.66,8.11 29.35,8.11 27.79,9.67 v26.71,9.67
  Bottom 0.254: R19.2 45.35,2.39 44.91,2.83 44.91,5 43.97,5.94 43.97,8.27 42.42,9.83 32,9.83 31.37,9.2 30.75,9.2 v29.66,8.11 | v18.15,9.98 19.08,9.05 24.84,9.05 25.46,9.67 v26.71,9.67
MISO
  Top 0.254: IC1.17 23.29,3.13 | 23.29,3.13 23.28,3.14 | U5.20 10.62,12.63 12.08,12.63 17.06,7.65 17.06,7.03 20.95,3.14 21.57,3.14 21.58,3.13 23.29,3.13
MOSI
  Top 0.254: U5.19 12.55,14.55 12.55,12.78 17.53,7.8 17.53,7.18 20.95,3.76 21.54,3.76 21.55,3.78 IC1.16
N$1  (via drill 0.36)
  Top 0.254: 25%.C 49.26,2.36 v48.95,2.05
  Bottom 0.254: R19.1 47.9,2.36 48.64,2.36 v48.95,2.05
N$2  (via drill 0.36)
  Top 0.254: U2.7 28.37,20.61 v28.88,20.09 | v32.31,28.03 32.31,29.33 U$7.P$2
  Bottom 0.254: v28.88,20.09 32,20.09 32.31,20.41 v32.31,28.03
N$3
  Top 0.254: 34.1,17.76 R3.2 30.1,17.73 29.66,17.29 29.66,16.31 U2.3
  Top 1.27: R2.1 34.1,17.76
N$4
  Top 0.406: 47.25,24.8 I1.A
  pour Top (rank 5, no thermals): 42.73,24.61 44.91,24.61 45.53,23.98 49.11,23.98 49.11,26.32 45.84,26.32 44.75,25.23 42.73,25.23
N$5
  Top 0.254: 46.89,16.54 I2.A
  pour Top (rank 2, no thermals): 42.73,16.36 44.75,16.36 45.38,15.74 48.95,15.74 48.95,18.07 45.69,18.07 44.44,16.83 42.73,16.83
N$6
  Top 0.254: U$1.8 41.57,25.45 41.17,25.85 41.17,29.27 41.02,29.43 R5.2
N$7
  Top 0.254: U$5.8 41.74,17.19 41.33,17.6 41.33,20.41 40.86,20.87 39.92,20.87 R1.2
N$8  (via drill 0.36)
  other vias: 10.53,30.05 10.53,28.03 10.53,26.16 10.53,24.76 9.44,23.21
  pour Top (no thermals): 13.79,22.74 13.79,30.52 4.46,30.52 4.46,22.74
  pour Bottom (isolate 0.305, no thermals): 10.99,22.74 10.99,30.52 4.46,30.52 4.46,22.74
N$9  (via drill 0.36)
  Top 0.254: POWER.A v51.44,28.96
  Bottom 0.254: v51.44,28.96 51.44,30.28 R13.1
N$10
  Top 0.61: R14.1 51.86,17.53 5V_POWER.A
N$11
  Top 0.406: U$4.2B 10.65,23.8 10.37,23.52 10.37,22.43 10.53,22.27 11.86,22.27 U1.1
N$12
  Top 0.406: U1.2 13.71,21.56 15.82,23.67 16.35,23.67 U$4.1B
N$13
  Top 0.254: STATUS.A 12.39,3.05 R6.2
N$33  (via drill 0.36)
  Top 0.254: 50%.C 48.76,4.34 v47.86,3.45
  Bottom 0.254: v47.86,3.45 47.86,4.46 R22.1
N$34  (via drill 0.36)
  Top 0.254: 75%.C 48.14,5.51 v47.86,5.63
  Bottom 0.254: v47.86,5.63 47.86,6.69 R21.1
N$35  (via drill 0.36)
  Top 0.254: 100%.C 49.24,8.3 v48.95,8.58
  Bottom 0.254: v48.95,8.58 47.88,8.58 | 47.71,8.74 47.88,8.58 | 47.88,8.58 R24.1
NC
  Top 0.254: U5.29 13.19,6.89 12.55,6.25 12.55,5.13 STATUS.C
OB_ALERT
  Top 0.254: U5.17 15.15,15.38 16.13,16.36 22.77,16.36 U$8.3
RST  (via drill 0.36)
  Top 0.254: U5.22 9.92,10.15 8.66,8.89 v5.24,8.89
  Bottom 0.254: U$2.RST 6.08,4.24 C1.1 R4.1 5.24,7.68 v5.24,8.89
RX0BF
  Top 0.254: U5.12 15.82,11.39 15.82,10.76 18.46,8.11 18.46,7.49 20.17,5.78 20.79,5.78 21.26,5.78 21.86,6.38 IC1.12
RX1BF
  Top 0.254: U5.11 16.44,11.11 16.44,10.76 18.93,8.27 18.93,7.65 20.33,6.25 20.95,6.25 21.57,6.87 22.66,6.87 22.82,7.03 IC1.11
RX_CAN  (via drill 0.36)
  Top 0.254: U6.4 54.57,9.22 53.78,8.43 51.13,8.43 48.49,11.07 v46.93,11.07 | IC1.2 30.22,1.83 v30.28,1.89
  Bottom 0.254: v46.93,11.07 45.69,12.32 29.51,12.32 28.88,11.69 28.88,6.09 31.22,3.76 31.22,2.83 v30.28,1.89
RXINT
  Top 0.254: U5.13 15.19,11.7 15.19,10.76 17.99,7.96 17.99,7.34 20.17,5.16 20.79,5.16 21.42,5.16 21.98,5.73 IC1.13
SCL  (via drill 0.36)
  Top 0.254: U$8.2 22.06,19.61 U1.12 16.11,19.61 v9.28,12.78 | 14.03,6.02 U5.31 14.19,6.02 15.35,7.18 v15.35,7.49
  Bottom 0.254: R9.2 22.53,18.56 U$8.2 | v15.35,7.49 15.35,7.65 14.26,8.74 13.79,8.74 13.64,8.58 12.86,8.58 9.13,12.32 9.13,12.63 v9.28,12.78
SDA  (via drill 0.36)
  Top 0.254: 20.96,20.27 U1.13 16.15,20.27 9.44,13.56 8.81,13.56 8.5,13.25 v8.5,12.16 | U$8.1 21.7,20.27 20.96,20.27 | 20.96,20.27 R8.2 | v14.1,7.96 14.42,7.65 14.42,7.22 U5.30
  Bottom 0.254: v8.5,12.16 8.5,12 12.55,7.96 v14.1,7.96
SMBALERT
  Top 0.254: U1.16 17.59,22.27 21.73,22.27 22.04,22.58 23.75,22.58 24.06,22.27 24.06,13.09 23.44,12.47 22.04,12.47 21.42,13.09 21.42,14.34 20.64,15.12 16.75,15.12 16.07,14.43 U5.15
STE
  Top 0.254: U5.36 15.66,2.98 15.66,2.67 16.59,1.74 20.95,1.74 21.73,2.51 23.33,2.51 IC1.18
TEST  (via drill 0.36)
  Top 0.254: 9.45,10.62 U5.21 8.57,9.67 4.61,9.67 3.53,8.58 v3.53,7.65
  Bottom 0.254: U$2.TST 4.81,3.57 4.3,4.07 3.68,4.07 3.53,4.23 v3.53,7.65
TRIGGER_CONVERT  (via drill 0.36)
  Top 0.254: U1.3 7.45,20.9 6.79,20.25 6.79,14.8 5.7,13.72 5.7,11.85 v5.86,11.69 | U5.27 11.77,7.34 11.77,7.18 10.84,6.25 v10.84,5.31
  Bottom 0.254: v5.86,11.69 6.01,11.69 8.97,8.74 8.97,5.63 9.9,4.69 10.53,4.69 10.84,5 v10.84,5.31
TX0RTS  (via drill 0.36)
  Top 0.254: IC1.4 27.96,3.13 26.55,4.54 v26.24,4.54 | v15.04,3.14 15.96,4.06 U5.35
  Bottom 0.254: v26.24,4.54 25.15,4.54 23.28,2.67 21.57,2.67 21.26,2.36 15.82,2.36 v15.04,3.14
TX1RTS  (via drill 0.36)
  Top 0.254: IC1.5 28.09,3.78 27.48,4.38 27.48,7.65 27.02,8.11 v26.39,8.11 | v20.64,7.03 20.17,7.03 19.39,7.8 19.39,8.43 19.08,8.74 19.08,9.16 U5.6
  Bottom 0.254: v20.64,7.03 21.57,7.96 26.08,7.96 v26.39,8.11
TX2RTS  (via drill 0.36)
  Top 0.254: IC1.7 28.34,5.08 28.11,5.31 28.11,8.58 27.79,8.89 v25.77,8.89 | U5.5 20.62,9.81 19.86,9.05 19.86,8.43 v20.33,7.96
  Bottom 0.254: v20.33,7.96 20.79,8.43 25.46,8.43 v25.77,8.89
TX_CAN  (via drill 0.36)
  Top 0.254: U6.1 51.13,11.07 50.2,11.07 v48.64,12.63 | IC1.1 30.5,1.18 31.06,1.74 31.06,2.51 v30.44,3.14
  Bottom 0.254: v48.64,12.63 48.33,12.94 29.04,12.94 28.42,12.32 28.42,5.16 v30.44,3.14
UART_RX
  Top 0.254: U5.24 10.87,9.23 8.81,7.18 8.81,1.92 U$2.RX
UART_TX
  Top 0.254: U5.23 10.4,9.7 5.24,4.54 3.37,4.54 2.28,3.45 2.28,1.74 U$2.TX
VBUS_ENABLE
  Top 0.254: U5.16 15.6,14.9 16.44,15.74 20.85,15.74 U$8.4
VCC_1  (via drill 0.36)
  Top 0.254: 36.14,17.84 C9.1 36.2,17.66 36.2,16.98
  Top 0.406: U$1.2 37.95,24.8 37.91,24.76 | U$5.2 37.57,16.54
  Top 0.61: 37.57,16.54 37.44,16.67
  Bottom 0.61: U$6.1 17.37,28.34 C13.1
  other vias: 20.48,29.74 20.17,23.36 18.77,28.03 18.77,25.85 18.77,23.98 27.48,29.74 31.22,26.16 24.37,26.78
  pour Top (isolate 0.305, rank 2, no thermals): 39.77,25.23 33.24,25.23 28.26,30.21 15.5,30.21 15.5,22.74 31.84,22.74 33.24,21.49 34.95,21.49 35.26,21.18 35.26,16.98 36.51,16.98 37.13,16.05 39.77,16.05 39.77,16.83 38.22,16.83 38.22,16.98 37.44,17.76 37.13,17.76 37.13,23.83 37.91,24.45 39.77,24.45
  pour Bottom (isolate 0.305, no thermals): 18.31,30.21 27.8,30.21 28.26,30.21 31.22,27.25 31.84,26.63 31.84,22.74 18.31,22.74
VCORE  (via drill 0.36)
  Top 0.254: U5.32 14.65,5.55 v15.66,6.56
  Bottom 0.254: v15.66,6.56 15.66,6.82 C2.1
VENABLE  (via drill 0.36)
  Top 0.254: U2.8 27.1,21.88 26.86,22.12 25.31,22.12 25.15,21.96 25.15,21.52 R12.1 v25.31,19.94
  Bottom 0.254: U$6.3 16.89,25.99 16.28,25.38 16.28,22.58 16.59,22.27 19.39,22.27 21.73,20.09 25.15,20.09 v25.31,19.94
XIN
  Top 0.254: 32.89,7.07 Q2.2 | C7.1 32.91,7.09 Q2.2 | IC1.9 32.17,6.38 Q2.2
XOUT
  Top 0.254: C8.1 36.5,3.5 Q2.1 35.18,2.2 33.86,2.2 30.34,5.73 IC1.8

### Text on the board
_tsilk: 3.3V | Vcc | 5V | GND | Signal | Battery